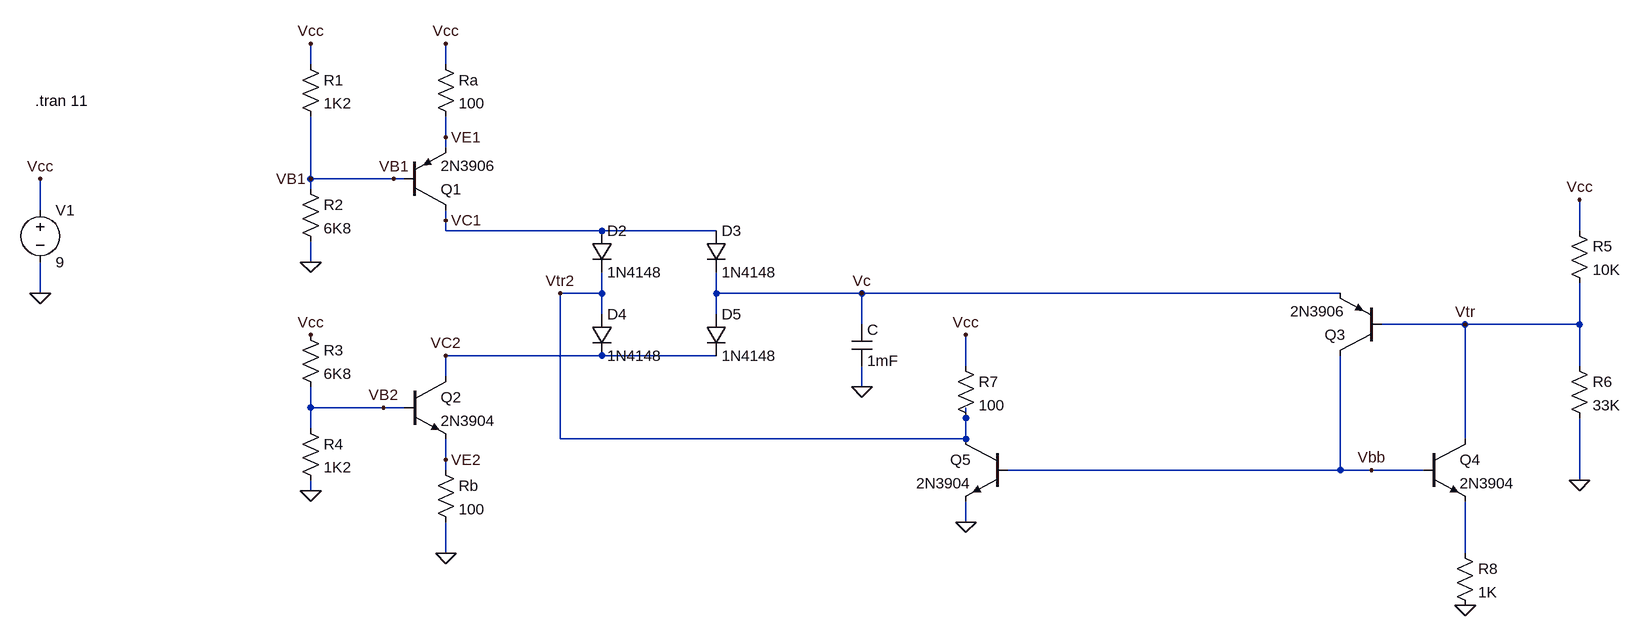
[diagram p0: schematic sawtooth-wave-generator-bjt-draft.asc]
sawtooth-wave-generator-bjt-draft.asc, the LTspice schematic file:
Version 4
SHEET 1 1076 740
WIRE -1696 -192 -1696 -224
WIRE -1488 -192 -1488 -224
WIRE -1488 -80 -1488 -112
WIRE -1488 -64 -1488 -80
WIRE -1696 -16 -1696 -112
WIRE -1568 -16 -1696 -16
WIRE -1552 -16 -1568 -16
WIRE -1696 0 -1696 -16
WIRE -2112 32 -2112 -16
WIRE -1488 48 -1488 32
WIRE -1488 64 -1488 48
WIRE -1248 64 -1488 64
WIRE -1072 64 -1248 64
WIRE 256 64 256 16
WIRE -1696 112 -1696 80
WIRE -2112 160 -2112 112
WIRE -1248 160 -1248 128
WIRE -1248 160 -1312 160
WIRE -1072 160 -1072 128
WIRE -848 160 -1072 160
WIRE -112 160 -848 160
WIRE -1248 192 -1248 160
WIRE -1072 192 -1072 160
WIRE -848 208 -848 160
WIRE 80 208 -48 208
WIRE 256 208 256 144
WIRE 256 208 80 208
WIRE -1248 256 -1488 256
WIRE -1072 256 -1248 256
WIRE -688 272 -688 224
WIRE 256 272 256 208
WIRE -1488 288 -1488 256
WIRE -848 304 -848 272
WIRE -1696 336 -1696 304
WIRE -1584 336 -1696 336
WIRE -1552 336 -1584 336
WIRE -688 352 -688 336
WIRE -1696 368 -1696 336
WIRE -1312 384 -1312 160
WIRE -688 384 -688 352
WIRE -688 384 -1312 384
WIRE 80 384 80 208
WIRE -1488 416 -1488 384
WIRE -1488 432 -1488 416
WIRE -112 432 -112 256
WIRE -112 432 -624 432
WIRE -64 432 -112 432
WIRE 16 432 -64 432
WIRE 256 448 256 352
WIRE -1696 464 -1696 448
WIRE -688 512 -688 480
WIRE -1488 560 -1488 512
WIRE 80 560 80 480
FLAG -2112 160 0
FLAG -848 304 0
FLAG -1488 -224 Vcc
FLAG -1696 -224 Vcc
FLAG -1488 48 VC1
FLAG -1696 -16 VB1
FLAG -1696 112 0
FLAG -2112 -16 Vcc
FLAG -1488 -80 VE1
FLAG -848 160 Vc
FLAG -1488 560 0
FLAG -1696 464 0
FLAG -1696 224 Vcc
FLAG 256 16 Vcc
FLAG 256 448 0
FLAG 80 208 Vtr
FLAG 80 640 0
FLAG -688 512 0
FLAG -688 224 Vcc
FLAG -1312 160 Vtr2
FLAG -64 432 Vbb
FLAG -1488 256 VC2
FLAG -1488 416 VE2
FLAG -1584 336 VB2
FLAG -1568 -16 VB1
SYMBOL voltage -2112 16 R0
WINDOW 123 0 0 Left 0
WINDOW 39 0 0 Left 0
SYMATTR InstName V1
SYMATTR Value 9
SYMBOL pnp -1552 32 M180
SYMATTR InstName Q1
SYMATTR Value 2N3906
SYMBOL res -1504 -208 R0
SYMATTR InstName Ra
SYMATTR Value 100
SYMBOL cap -864 208 R0
SYMATTR InstName C
SYMATTR Value 1mF
SYMBOL res -1712 -16 R0
SYMATTR InstName R2
SYMATTR Value 6K8
SYMBOL diode -1264 64 R0
SYMATTR InstName D2
SYMATTR Value 1N4148
SYMBOL diode -1088 64 R0
SYMATTR InstName D3
SYMATTR Value 1N4148
SYMBOL diode -1264 192 R0
SYMATTR InstName D4
SYMATTR Value 1N4148
SYMBOL diode -1088 192 R0
SYMATTR InstName D5
SYMATTR Value 1N4148
SYMBOL npn -1552 288 R0
SYMATTR InstName Q2
SYMATTR Value 2N3904
SYMBOL res -1504 416 R0
SYMATTR InstName Rb
SYMATTR Value 100
SYMBOL res -1712 208 R0
SYMATTR InstName R3
SYMATTR Value 6K8
SYMBOL pnp -48 256 R180
SYMATTR InstName Q3
SYMATTR Value 2N3906
SYMBOL res 240 256 R0
SYMATTR InstName R6
SYMATTR Value 33K
SYMBOL res 240 48 R0
SYMATTR InstName R5
SYMATTR Value 10K
SYMBOL npn 16 384 R0
SYMATTR InstName Q4
SYMATTR Value 2N3904
SYMBOL npn -624 384 M0
SYMATTR InstName Q5
SYMATTR Value 2N3904
SYMBOL res -704 256 R0
SYMATTR InstName R7
SYMATTR Value 100
SYMBOL res 64 544 R0
SYMATTR InstName R8
SYMATTR Value 1K
SYMBOL res -1712 -208 R0
SYMATTR InstName R1
SYMATTR Value 1K2
SYMBOL res -1712 352 R0
SYMATTR InstName R4
SYMATTR Value 1K2
TEXT -2120 -136 Left 2 !.tran 11

The netlist it stands for:
* sawtooth-wave-generator-bjt-draft.asc
V1 Vcc 0 9
Q1 VC1 VB1 VE1 0 2N3906
Ra Vcc VE1 100
C Vc 0 1mF
R2 VB1 0 6K8
D2 VC1 Vtr2 1N4148
D3 VC1 Vc 1N4148
D4 Vtr2 VC2 1N4148
D5 Vc VC2 1N4148
Q2 VC2 VB2 VE2 0 2N3904
Rb VE2 0 100
R3 Vcc VB2 6K8
Q3 Vbb Vtr Vc 0 2N3906
R6 Vtr 0 33K
R5 Vcc Vtr 10K
Q4 Vtr Vbb N001 0 2N3904
Q5 Vtr2 Vbb 0 0 2N3904
R7 Vcc Vtr2 100
R8 N001 0 1K
R1 Vcc VB1 1K2
R4 VB2 0 1K2
.model D D
.lib standard.dio
.model NPN NPN
.model PNP PNP
.lib standard.bjt
.tran 11
.backanno
.end